# EAGLE design sanro (EAGLE 7.5.0)
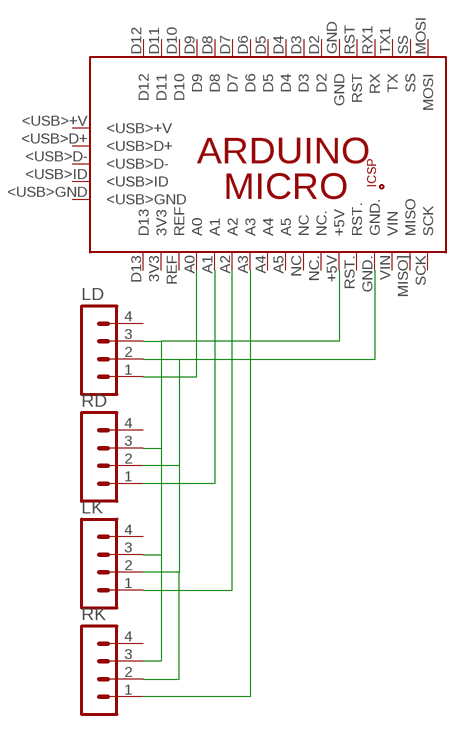
[diagram p0: schematic, sheet 1]

## Parts
LD  MA04-1  [MA04-1]
LK  MA04-1  [MA04-1]
PCB1  ARDUINO_MICRO  [ARDUINO_MICRO]
RD  MA04-1  [MA04-1]
RK  MA04-1  [MA04-1]

## Nets
N$1: LD.1 PCB1.A0
N$2: PCB1.A1 RD.1
N$3: LK.1 PCB1.A2
N$4: PCB1.A3 RK.1
N$5: LD.2 LK.2 PCB1.GND. RD.2 RK.2
N$6: LD.3 LK.3 PCB1.+5V RD.3 RK.3
Unconnected: LD.4 LK.4 PCB1.3V3 PCB1.5V PCB1.<USB>+V PCB1.<USB>D+ PCB1.<USB>D- PCB1.<USB>GND PCB1.<USB>ID PCB1.A4 PCB1.A5 PCB1.D2 PCB1.D3 PCB1.D4 PCB1.D5 PCB1.D6 PCB1.D7 PCB1.D8 PCB1.D9 PCB1.D10 PCB1.D11 PCB1.D12 PCB1.D13 PCB1.GND PCB1.GND_ PCB1.MISO. PCB1.MISO](MISO) PCB1.MOSI PCB1.MOSI. PCB1.NC PCB1.NC. PCB1.REF PCB1.RESET.. PCB1.RST PCB1.RST. PCB1.RX1(RX) PCB1.SCK PCB1.SCK. PCB1.SS PCB1.TX1(TX) PCB1.VIN RD.4 RK.4

## Library data of the parts
LD LK RD RK = con-lstb:MA04-1: PIN HEADER; OC_FARNELL: unknown; OC_NEWARK: unknown
PCB1 = E14_Arduino_revB:ARDUINO_MICRO: Device for representing an Arduino Micro board with a footprint in an EAGLE design. Created by Dave Young for Element14. More EAGLE documentation at: http://www.element14.com/community/community/knode/cadsoft_eagle

## Board
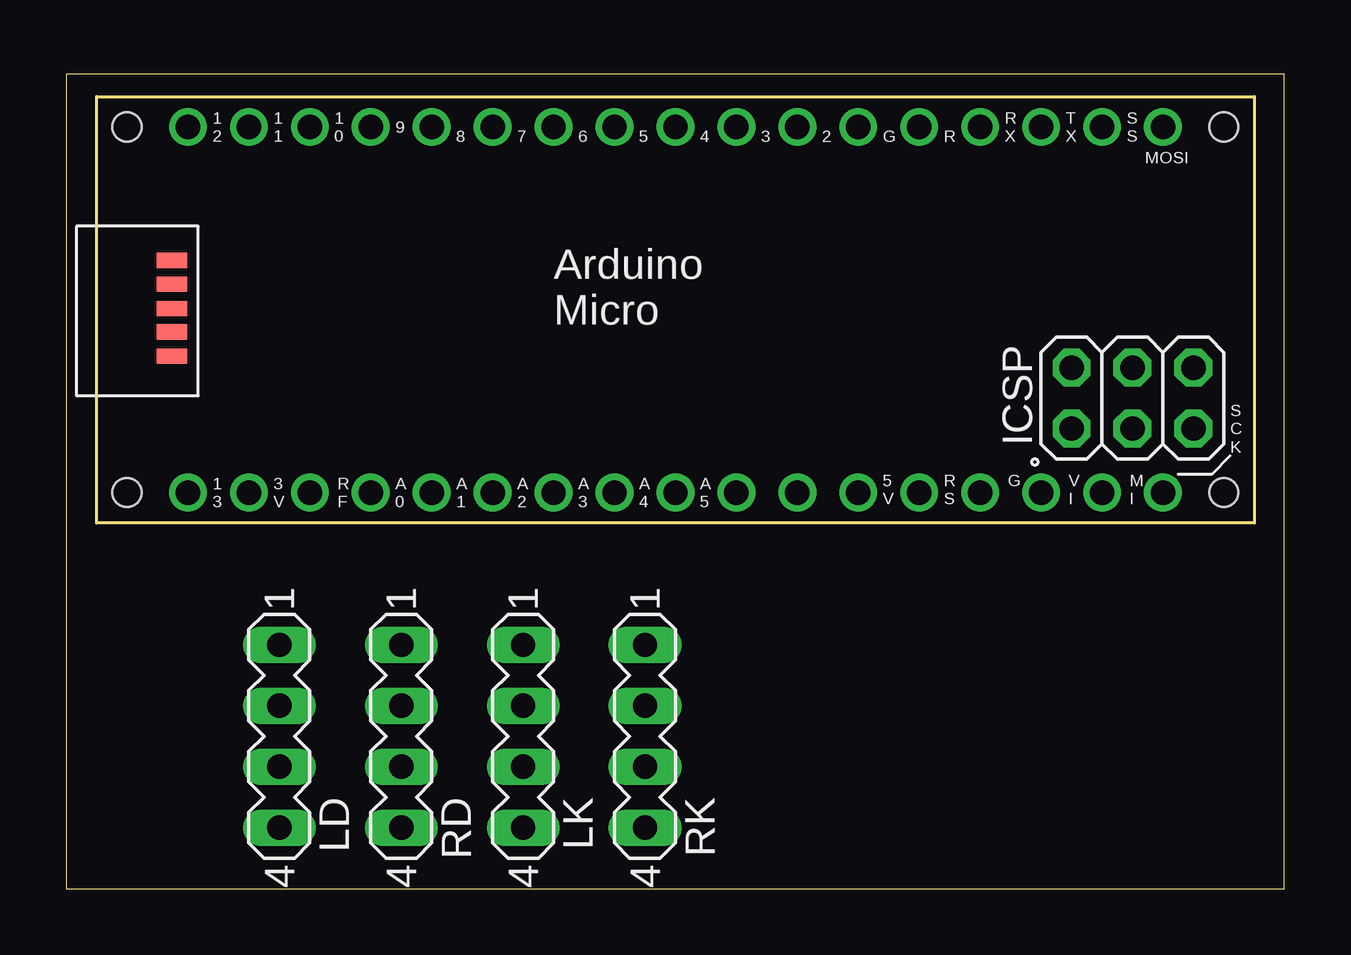
[diagram p1: board, top side]
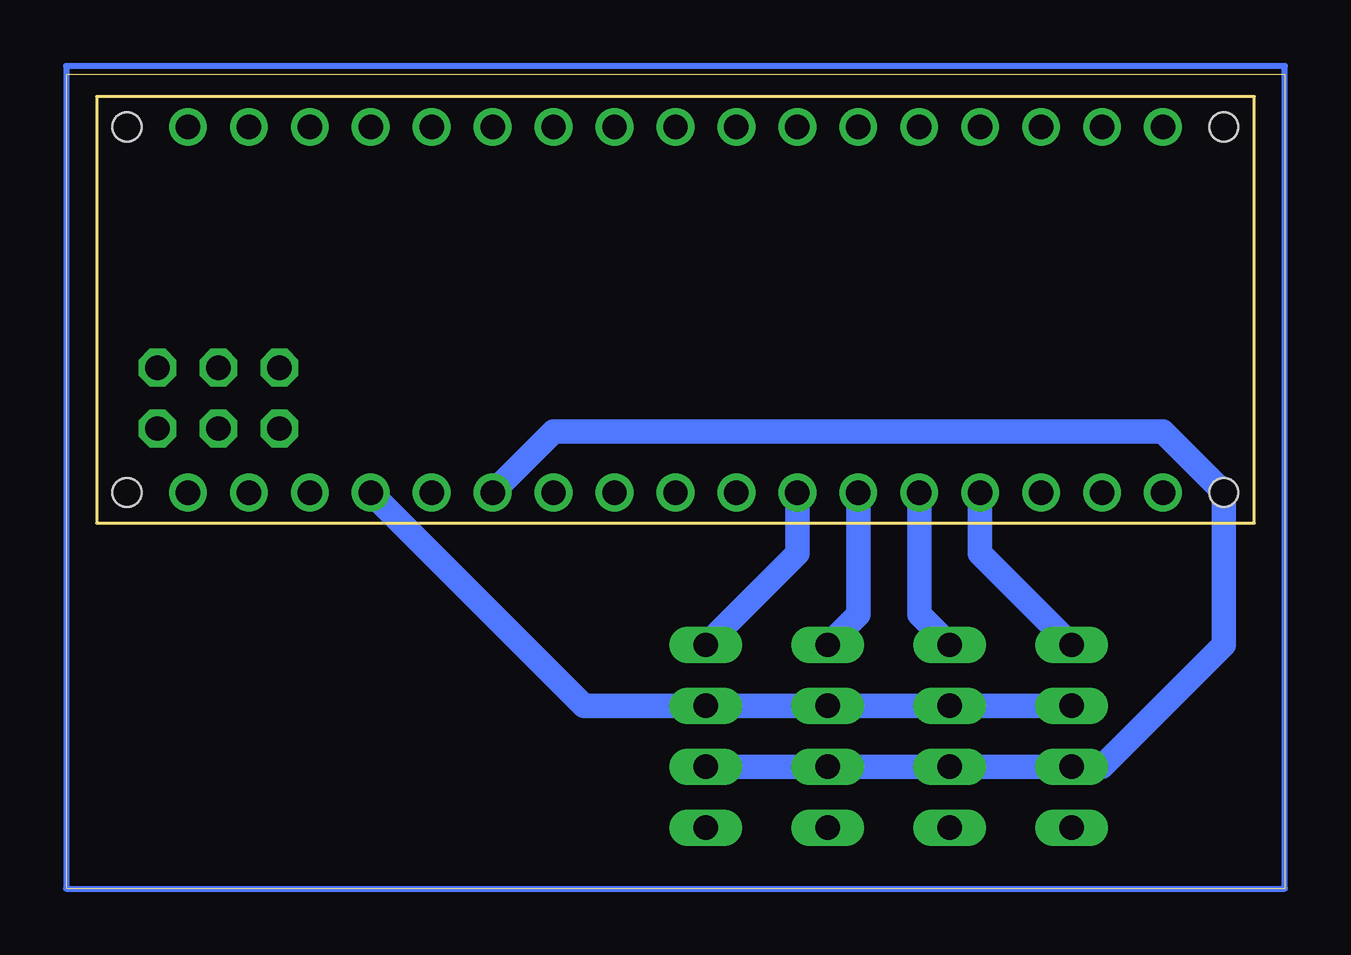
[diagram p2: board, bottom side, seen from below]

Size 50.78 x 33.96 mm. Coordinates in mm from the lower left corner, seen from the top.
Outline: 0,0 50.78,0 50.78,33.96 0,33.96 0,0
Copper layers (1*16): Top 0.035mm / dielectric 1.5mm / Bottom 0.035mm
Design rules "default": minimum track width 10mil, minimum drill 24mil, track to track 8mil, track to pad 8mil, pad to pad 8mil, via to via 8mil, smd to smd 8mil, copper to edge 40mil, drill to drill 8mil, minimum pad ring 10mil, minimum via ring 8mil, stop-mask expansion 4mil, vias tented up to drill 0mil, thermal gap 10mil

### Footprints (pad centres in the part's own frame; a part is rotated, then mirrored left to right if it is on the bottom)
MA04-1 = drill 1.016 long: 1 -3.81,0; 2 -1.27,0; 3 1.27,0; 4 3.81,0
ARDUINO_MICRO = drill 1.016 pad 1.575: 3V3 6.35,1.27; +5V 31.75,1.27; A0 11.43,1.27; A1 13.97,1.27; A2 16.51,1.27; A3 19.05,1.27; A4 21.59,1.27; A5 24.13,1.27; D2 29.21,16.51; D3 26.67,16.51; D4 24.13,16.51; D5 21.59,16.51; D6 19.05,16.51; D7 16.51,16.51; D8 13.97,16.51; D9 11.43,16.51; D10 8.89,16.51; D11 6.35,16.51; D12 3.81,16.51; D13 3.81,1.27; GND 31.75,16.51; GND. 36.83,1.27; MISO] 41.91,1.27; MOSI 44.45,16.51; NC 26.67,1.27; NC. 29.21,1.27; REF 8.89,1.27; RST 34.29,16.51; RST. 34.29,1.27; RX1 36.83,16.51; SCK 44.45,1.27; SS 41.91,16.51; TX1 39.37,16.51; VIN 39.37,1.27 | drill 1.016 pad 1.575 octagon: 5V 40.64,6.477; GND_ 45.72,6.477; MISO. 40.64,3.937; MOSI. 43.18,6.477; RESET.. 45.72,3.937; SCK. 43.18,3.937 | smd 1.27 x 0.635: <USB>+V 3.15,10.947; <USB>D+ 3.15,9.957; <USB>D- 3.15,8.941; <USB>GND 3.15,6.96; <USB>ID 3.15,7.976 | hole 1.2: 1.27,1.27; 1.27,16.51; 46.99,16.51; 46.99,1.27

### Placement (x,y rotation side)
LD  8.89,6.35 270 top
LK  19.05,6.35 270 top
PCB1  1.27,15.24 0 top
RD  13.97,6.35 270 top
RK  24.13,6.35 270 top

### Tracks (layer width: path | path; a pad name or v marks a point on that pad's centre or on a via)
N$1
  Bottom 1.016: LD.1 12.7,13.97 PCB1.A0
N$2
  Bottom 1.016: RD.1 15.24,11.43 PCB1.A1
N$3
  Bottom 1.016: LK.1 17.78,11.43 PCB1.A2
N$4
  Bottom 1.016: RK.1 20.32,13.97 PCB1.A3
N$5
  Bottom 1.016: LD.2 RD.2 LK.2 RK.2 29.21,7.62 PCB1.GND.
N$6
  Bottom 1.016: RK.3 LK.3 RD.3 LD.3 7.62,5.08 2.54,10.16 2.54,16.51 5.08,19.05 30.48,19.05 PCB1.+5V
N$7
  Bottom 0.254: 0,34.29 50.8,34.29 50.8,0 0,0 0,34.29